# EAGLE design DPS368_SensorBreakout (EAGLE 9.2.1)
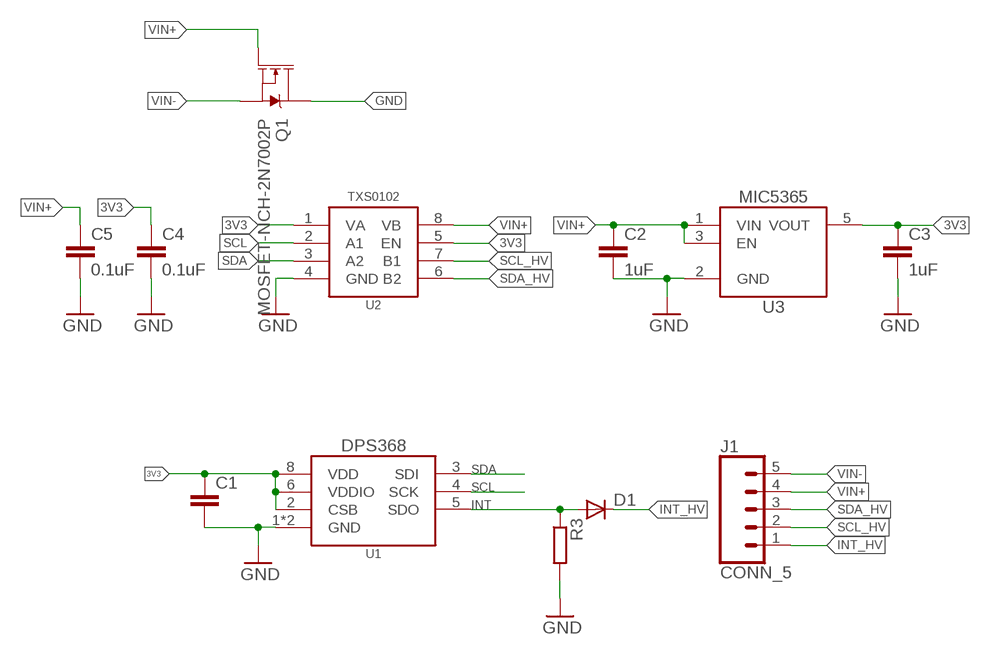
[diagram p0: schematic, sheet 1]

## Parts
C1  C-EU0.1UFC0603  [C0603]
C2  1uF  C-EU1UFC0603  [C0603]
C3  1uF  C-EU1UFC0603  [C0603]
C4  0.1uF  C-EU0.1UFC0603  [C0603]
C5  0.1uF  C-EU0.1UFC0603  [C0603]
D1  DIODESOD-323  [SOD323-R]
J1  CONN_5  [1X05]
Q1  MOSFET-NCH-2N7002P  [SOT23-3]
R3  R-EU_100KR0603  [R0603]
U1  DPS368  [PG-VLGA-8]
U2  TXS0102DQM  [DQM_R-PX2SON-N8]
U3  MIC53653.3SC70  [DCK_R-PDSO-G5]

## Nets
3V3: C1.1 C3.1 C4.1 U1.2(CSB) U1.6(VDDIO) U1.8(VDD) U2.1(VA) U2.5(EN) U3.5(VOUT)
GND: C1.2 C2.2 C3.2 C4.2 C5.2 Q1.3(D) R3.2 U1.1(GND) U1.7(GND) U2.4(GND) U3.2(GND)
INT: D1.A R3.1 U1.5(SDO)
INT_HV: D1.C J1.1
SCL: U1.4(SCK) U2.2(A1)
SCL_HV: J1.2 U2.7(B1)
SDA: U1.3(SDI) U2.3(A2)
SDA_HV: J1.3 U2.6(B2)
VIN+: C2.1 C5.1 J1.4 Q1.1(G) U2.8(VB) U3.1(VIN) U3.3(EN)
VIN-: J1.5 Q1.2(S)

## Library data of the parts
C1 C4 C5 = bschulz_passives:C-EU: CAPACITOR, European symbol; DIGIKEY: 490-6051-1-ND; MF: Murata; MPN: GCM188R71E104KA57D
C2 C3 = bschulz_passives:C-EU: CAPACITOR, European symbol; DIGIKEY: 490-10479-1-ND; MF: Murata; MPN: GRM188R61C105KA12D
D1 = bschulz:DIODE: Genaric Diode
J1 = bschulz:CONN_5: Genaric 5 terminal header; DIGIKEY: ED10564-ND; MF: On Shore; MPN: OSTVN05A150
Q1 = bschulz:MOSFET-NCH: N-channel MOSFETs Voltage controlled devices that allow control of high current outputs. SparkFun Products: SparkFun OpenScale <https://www.sparkfun.com/products/13261> SparkFun Digital Sandbox <https://www.sparkfun.com/products/12651> SparkFun Monster Moto Shield <https://www.sparkfun.com/products/10182> SparkFun MOSFET Power Controller <https://www.sparkfun.com/products/11214>; DIGIKEY: 1727-4692-1-ND; MF: Nexperia; MPN: 2N7002P,215
R3 = bschulz_passives:R-EU_: RESISTOR, European symbol Digikey Parts: Yageo, 0402 <https://www.digikey.com/products/en/resistors/chip-resistor-surface-mount/52?k=&pkeyword=&sf=0&FV=ffec1104%2Cfffc000d%2C1c0002%2C440067%2C1f140000%2Cffe00034%2C400004&quantity=&ColumnSort=0&page=1&stock=1&pageSize=25> Yageo, 0603 <https://www.digikey.com/products/en/resistors/chip-resistor-surface-mount/52?k=&pkeyword=&s=4356&s=47360&sf=0&FV=fffc000d%2C1c0002%2C142c040c%2C1f140000%2Cffe00034&quantity=10&ColumnSort=1000011&page=1&stock=1&pageSize=25> Panasonic, 0603 <https://www.digikey.com/products/en/resistors/chip-resistor-surface-mount/52?k=&pkeyword=&pv252=68&sf=0&FV=ffec373d%2C1c0002%2C142c040c%2C1f140000%2Cffe00034%2C80002%2Cc0001&quantity=&ColumnSort=0&page=1&stock=1&pageSize=25> Panasonic, precision, 0603 <https://www.digikey.com/products/en/resistors/chip-resistor-surface-mount/52?FV=ffec4907%2Cfffc000a%2Cc0172%2C142c040c%2C1f140000%2Cffe00034%2C1c0002&quantity=100&ColumnSort=2085&page=1&stock=1&pageSize=25> Panasonic, 0805 <https://www.digikey.com/products/en/resistors/chip-resistor-surface-mount/52?k=&pkeyword=&pv3=1&sf=0&FV=ffec373d%2C1c0002%2C1f140000%2Cffe00034%2C142c040d&quantity=&ColumnSort=0&page=1&stock=1&pageSize=25> Rohm, current sense <https://www.digikey.com/products/en/resistors/chip-resistor-surface-mount/52?k=&pkeyword=&pv3=1&sf=0&FV=ffecb688%2C1f140000%2Cffe00034%2C1c0002&quantity=&ColumnSort=0&page=1&stock=1&pageSize=25> Vishay, pulse proof automotive <https://www.digikey.com/products/en/resistors/chip-resistor-surface-mount/52?k=&pkeyword=&pv7=2&sf=0&FV=ffec5d6b%2Cffe00034%2C1f140000&quantity=&ColumnSort=0&page=1&stock=1&pageSize=25>; DIGIKEY: RC0402FR-071ML; MF: Yageo; MPN: RC0603FR-07100KL; VALUE_PART: 100k
U1 = bschulz:DPS368: DPS368 - Digital Pressure Sensor Characteristics: Vcc: 1.7V ~ 3.6V Pressure Range: 300 ~ 1200 mBar Pressure Resolution: 0.002 mBar, max Pressure Accuracy: relative ±0.06 mBar, abs ± 1 mBar Temperature Resolution: 0.01°C Temperature Accuracy: 0.5°C Operating Temperature: -40°C to 85°C Digikey: DPS368XTSA1CT-ND <https://www.digikey.com/product-detail/en/DPS368XTSA1/DPS368XTSA1CT-ND/10244081/?itemSeq=300835075>; DIGIKEY: DPS368XTSA1CT-ND; DISP: DPS368; MF: Infineon; MPN: DPS368XTSA1
U2 = bschulz:TXS0102: TXS0102 - 2 Channel Bidirectional Voltage Level Translator Characteristics: Vcc: 1.65 ~ 3.6V (Port A), 2.3 ~ 5.5V (Port B) IQ: 14.4μA Output Current: 50mA Output Type: Open Drain/Push-Pull Operating Temperature: -40°C to 85°C Digikey: 296-28368-1-ND (DQE) <https://www.digikey.com/product-detail/en/texas-instruments/TXS0102DQER/296-28368-1-ND/2625893> 296-28435-1-ND (DQM) <https://www.digikey.com/product-detail/en/texas-instruments/TXS0102DQMR/296-28435-1-ND/2638910> 296-21931-1-ND (DCU) <https://www.digikey.com/product-detail/en/texas-instruments/TXS0102DCUR/296-21931-1-ND/1629284>; DIGIKEY: 296-28435-1-ND; MF: TI; MPN: TXS0102DQMR
U3 = bschulz:MIC5365: MIC5365-* - Low Power, High Performance, Linear Regulator Characteristics: Vin: 2.5V ~ 5.5V Vout: Many options, (1v ~ 3.3v) see datasheet <http://ww1.microchip.com/downloads/en/DeviceDoc/mic5365.pdf> IQ: 29μA typ Dropout Voltage: 55mV @ 50mA, input ≥ 2.8v Voltage Accuracy: 2% typ Output Current: 150 mA Operating Temperature: -40°C to 125°C Mouser: MIC5365-3.3YC5 (3.3V Fixed) <https://www.digikey.com/product-detail/en/microchip-technology/MIC5365-3.3YC5-TR/576-3193-1-ND/1868230> MIC5365-1.8YC5 (1.8V Fixed) <https://www.digikey.com/products/en/integrated-circuits-ics/pmic-voltage-regulators-linear/699?k=mic5365&k=&pkeyword=mic5365&sv=0&pv1291=881&sf=0&FV=1c0002%2C1f140000%2Cffe002bb%2C1bcc0020&quantity=&ColumnSort=0&page=1&stock=1&pageSize=25>; DIGIKEY: 576-3193-1-ND; MF: Microchip; MPN: MIC5365-3.3YC5-TR

## Board
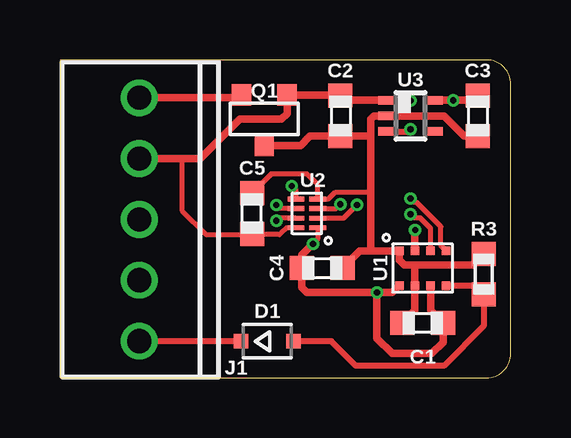
[diagram p1: board, top side]
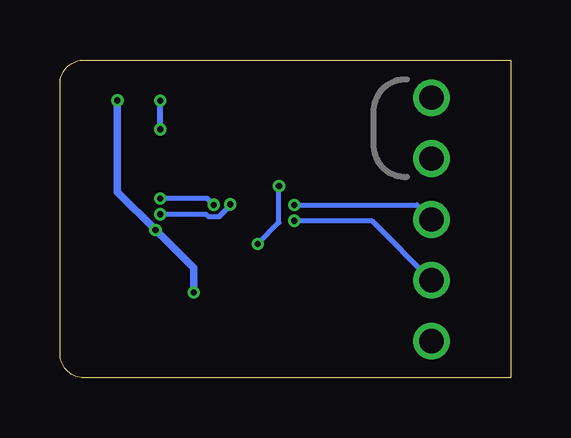
[diagram p2: board, bottom side, seen from below]

Size 18.78 x 13.26 mm. Coordinates in mm from the lower left corner, seen from the top.
Outline: 0,0 17.78,0 arc90 18.78,1 18.78,12.26 arc90 17.78,13.26 0,13.26 0,0
Copper layers (1*16): Top 0.035559375mm / dielectric 1.6mm / Bottom 0.035559375mm
Design rules "oshpark-2layer": minimum track width 6mil, minimum drill 10mil, track to track 6mil, track to pad 6mil, pad to pad 6mil, via to via 6mil, smd to smd 6mil, copper to edge 15mil, drill to drill 6mil, minimum pad ring 5mil, minimum via ring 5mil, stop-mask expansion 2.5mil, vias tented up to drill 0mil, thermal gap 10mil

### Footprints (pad centres in the part's own frame; a part is rotated, then mirrored left to right if it is on the bottom)
C0603 = smd 1 x 1: 1 -0.85,0; 2 0.85,0
SOD323-R = smd 0.6 x 0.6: A 1.1,0; C -1.1,0
1X05 = drill 1.016: 1 -3.81,0; 2 -1.27,0; 3 1.27,0; 4 3.81,0; 5 6.35,0
SOT23-3 = smd 0.8 x 0.9: 1 -0.95,-1; 2 0.95,-1; 3 0,1.1
R0603 = smd 1 x 1: 1 -0.85,0; 2 0.85,0
PG-VLGA-8 = smd 0.35 x 0.35: 1 0.725,0.975; 2 0.725,0.325; 3 0.725,-0.325; 4 0.725,-0.975; 5 -0.725,-0.975; 6 -0.725,-0.325; 7 -0.725,0.325; 8 -0.725,0.975
DQM_R-PX2SON-N8 = smd 0.2 x 0.7: 1 -0.6,-0.45; 2 -0.2,-0.45; 3 0.2,-0.45; 4 0.6,-0.45; 5 0.6,0.45; 6 0.2,0.45; 7 -0.2,0.45; 8 -0.6,0.45
DCK_R-PDSO-G5 = smd 0.35 x 0.8: 1 -0.65,-0.95; 2 0,-0.95; 3 0.65,-0.95; 4 0.65,0.95; 5 -0.65,0.95

### Placement (x,y rotation side)
C1  15.11,2.29 180 top
C2  11.68,10.92 270 top
C3  17.4,10.92 270 top
C4  10.92,4.57 0 top
C5  8,6.86 90 top
D1  8.64,1.52 0 top
J1  3.3,5.33 90 top
Q1  8.51,10.79 180 top
R3  17.65,4.32 90 top
U1  15.11,4.57 90 top
U2  10.29,6.86 90 top
U3  14.61,10.92 270 top

### Tracks (layer width: path | path; a pad name or v marks a point on that pad's centre or on a via)
3V3  (via drill 0.25)
  Top 0.2: U2.5 9.84,7.82 v9.65,8 | U2.1 10.74,5.78 v10.54,5.59
  Top 0.305: U3.5 v16.38,11.57 17.2,11.57 C3.1 | U1.6 15.44,2.81 C1.1 15.96,1.49 15.49,1.02 13.84,1.02 13.21,1.65 v13.21,3.56 | v10.54,5.59 10.07,5.12 C4.1 10.07,3.77 10.29,3.56 v13.21,3.56 | v13.21,3.56 13.85,3.56 U1.8 | U1.2 14.79,6.15 v14.8,6.16
  Bottom 0.2: v10.54,5.59 9.65,6.48 v9.65,8
  Bottom 0.305: v16.38,11.57 16.38,7.75 v14.8,6.16 13.21,4.57 v13.21,3.56
GND
  Top 0.2: 12.95,7.75 11.56,7.75 11.55,7.75 11.47,7.75 11.19,7.46 U2.4 10.74,8.06 10.29,8.51 8.8,8.51 C5.2
  Top 0.305: Q1.3 10.04,9.7 10.41,10.07 C2.2 12.85,10.07 12.95,9.97 | C3.2 16.85,10.07 16,10.92 U3.2 13.08,10.92 12.95,10.79 12.95,9.97 | 14.73,4.7 14.35,4.7 14.14,4.91 U1.1 12.95,5.3 | 14.73,4.7 17.18,4.7 R3.2 | 14.73,4.7 14.79,4.64 U1.7 14.79,2.81 C1.2 | 12.95,5.3 12.5,5.3 C4.2 | 12.95,9.97 12.95,7.75 12.95,5.3
INT
  Top 0.254: U1.5 17.27,3.85 R3.1 17.65,2.16 16,0.51 12.32,0.51 11.3,1.52 D1.A
INT_HV
  Top 0.254: D1.C J1.1
SCL  (via drill 0.25)
  Top 0.2: U1.4 15.87,5.52 15.87,6.3 14.84,7.33 14.76,7.33 v14.61,7.48 | U2.2 11.82,6.66 v12.38,7.21
  Bottom 0.2: v12.38,7.21 12.64,7.48 v14.61,7.48
SCL_HV  (via drill 0.25)
  Top 0.2: U2.7 9.12,6.66 v9.02,6.55
  Bottom 0.2: v9.02,6.55 5.79,6.55 J1.2
SDA  (via drill 0.25)
  Top 0.2: v14.61,6.82 14.76,6.67 15.01,6.67 15.44,6.23 U1.3 | U2.3 11.5,7.06 v11.68,7.24
  Bottom 0.2: v11.68,7.24 11.68,7.19 12.16,6.71 12.59,6.71 12.7,6.82 v14.61,6.82
SDA_HV  (via drill 0.25)
  Top 0.2: U2.6 9.07,7.06 9.02,7.11 v9.02,7.21
  Bottom 0.2: v9.02,7.21 3.91,7.21 J1.3
VIN+  (via drill 0.25)
  Top 0.2: U2.8 9.44,6.26 9.23,6.04 9.22,6.04 9.14,5.97 8.04,5.97 | 8.04,5.97 C5.1 | 5.08,9.14 5.08,6.99 6.1,5.97 8.04,5.97
  Top 0.254: U3.3 14.51,10.27 v14.61,10.36 | v14.61,11.56 13.67,11.56 U3.1
  Top 0.305: U3.1 11.88,11.57 C2.1 11.66,11.79 Q1.1 9.46,11.02 9.23,10.79 7.48,10.79 5.84,9.14 5.08,9.14 J1.4
  Bottom 0.254: v14.61,10.36 v14.61,11.56
VIN-
  Top 0.305: J1.5 7.45,11.68 Q1.2

### Text on the board
bDocu: GND | ± | Vin | DPS368 Breakout / B Schulz / v0.0 | SDA | SCL | INT